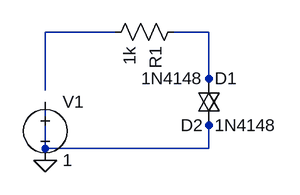
[diagram p0: schematic diode_clipper.asc]
diode_clipper.asc, the LTspice schematic file:
Version 4
SHEET 1 880 680
WIRE 192 96 96 96
WIRE 320 96 272 96
WIRE 320 160 320 96
WIRE 320 224 320 224
WIRE 96 176 96 96
WIRE 320 256 320 224
WIRE 96 256 96 192
WIRE 320 256 96 256
WIRE 96 272 96 256
FLAG 96 272 0
SYMBOL voltage 96 176 R0
SYMATTR InstName V1
SYMATTR Value 1
SYMBOL res 288 80 R90
SYMATTR InstName R1
SYMATTR Value 1k
SYMBOL diode 304 160 R0
SYMATTR InstName D1
SYMATTR Value 1N4148
SYMBOL diode 336 224 R180
SYMATTR InstName D2
SYMATTR Value 1N4148

The netlist it stands for:
* diode_clipper.asc
V1 0 0 1
R1 N002 N001 1k
D1 N002 0 1N4148
D2 0 N002 1N4148
.model D D
.lib standard.dio
.backanno
.end